# EasyEDA schematic SCH_Vansh_2023-10-03.json
TITLE: Sheet_1; REV: 1.0; Date: 2023-10-01; Sheet: 1/1; Drawn By: Vansh Gaba; Company: Your Company
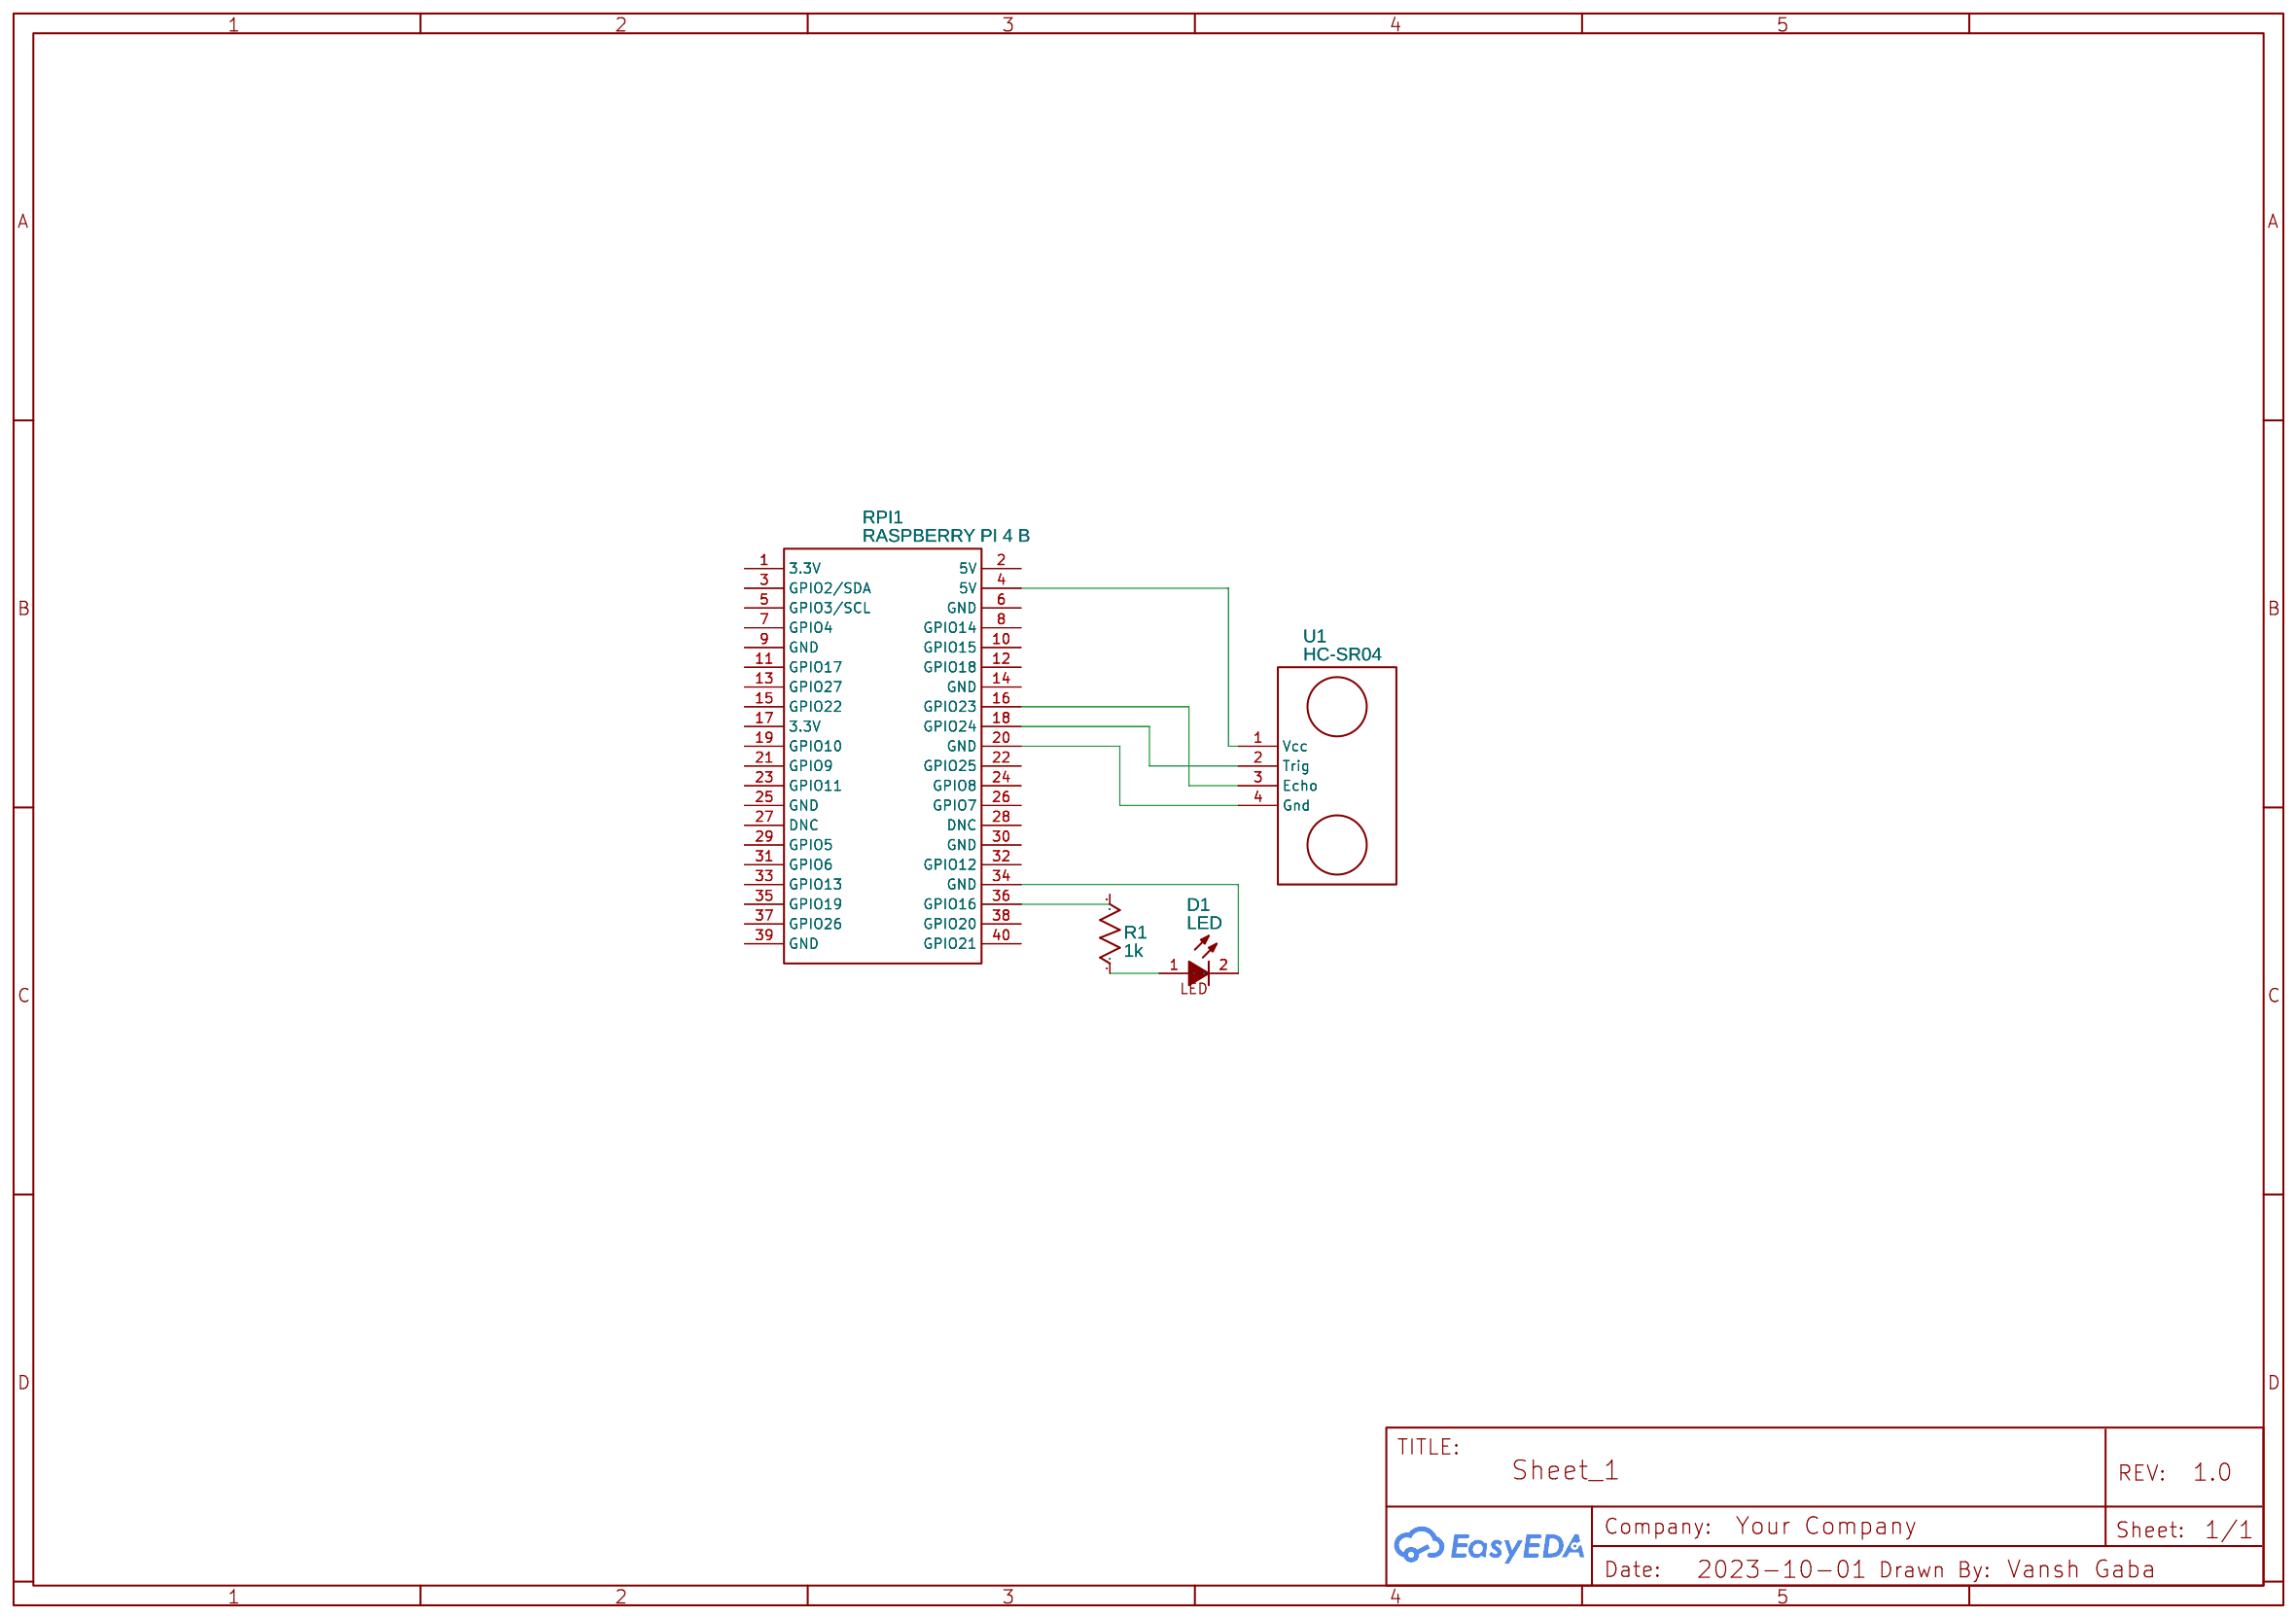
[diagram p0: schematic sheet]

## Parts
D1  LED  [LED-TH_LED-DP2-2LED-AMCC]
R1  1k  [R0603]
RPI1  RASPBERRY PI 4 B  [HDR-20X2/2.54]
U1  HC-SR04  [HCSR04]

## Library data of the parts
D1 = LED: Supplier: Digi-Key; Manufacturer: VccLite; Manufacturer Part: 5600; Supplier Part: L20325-ND; link: https://vcclite.com/product/5602f5-5v/; Contributor: robosnake26
R1 = R_0603_US: Contributor: LCEDA_Lib
RPI1 = RASPBERRY PI 3 B+: Contributor: Buse Karakoç; Supplier: Adafruit; Manufacturer: Raspberry Pi; Supplier Part: 3775; Manufacturer Part: Raspberry Pi 3 - Model B+ - 1.4GHz Cortex-A53 with 1GB RAM
U1 = HC-SR04: Contributor: rabah_rzk

## Nets
Net-(D1-1): D1.1(A) R1.1
Net-(D1-2): D1.2(K) RPI1.34(GND)
Net-(R1-2): R1.2 RPI1.36(GPIO16)
Net-(RPI1-4): RPI1.4(5V) U1.1(Vcc)
Net-(RPI1-16): RPI1.16(GPIO23) U1.3(Echo)
Net-(RPI1-18): RPI1.18(GPIO24) U1.2(Trig)
Net-(RPI1-20): RPI1.20(GND) U1.4(Gnd)

Not connected (* = marked no-connect by the designer): RPI1 1(3.3V) 2(5V) 3(GPIO2/SDA) 5(GPIO3/SCL) 6(GND) 7(GPIO4) 8(GPIO14) 9(GND) 10(GPIO15) 11(GPIO17) 12(GPIO18) 13(GPIO27) 14(GND) 15(GPIO22) 17(3.3V) 19(GPIO10) 21(GPIO9) 22(GPIO25) 23(GPIO11) 24(GPIO8) 25(GND) 26(GPIO7) 27(DNC) 28(DNC) 29(GPIO5) 30(GND) 31(GPIO6) 32(GPIO12) 33(GPIO13) 35(GPIO19) 37(GPIO26) 38(GPIO20) 39(GND) 40(GPIO21)
